# EAGLE schematic StreamDeck (EAGLE 9.6.2)
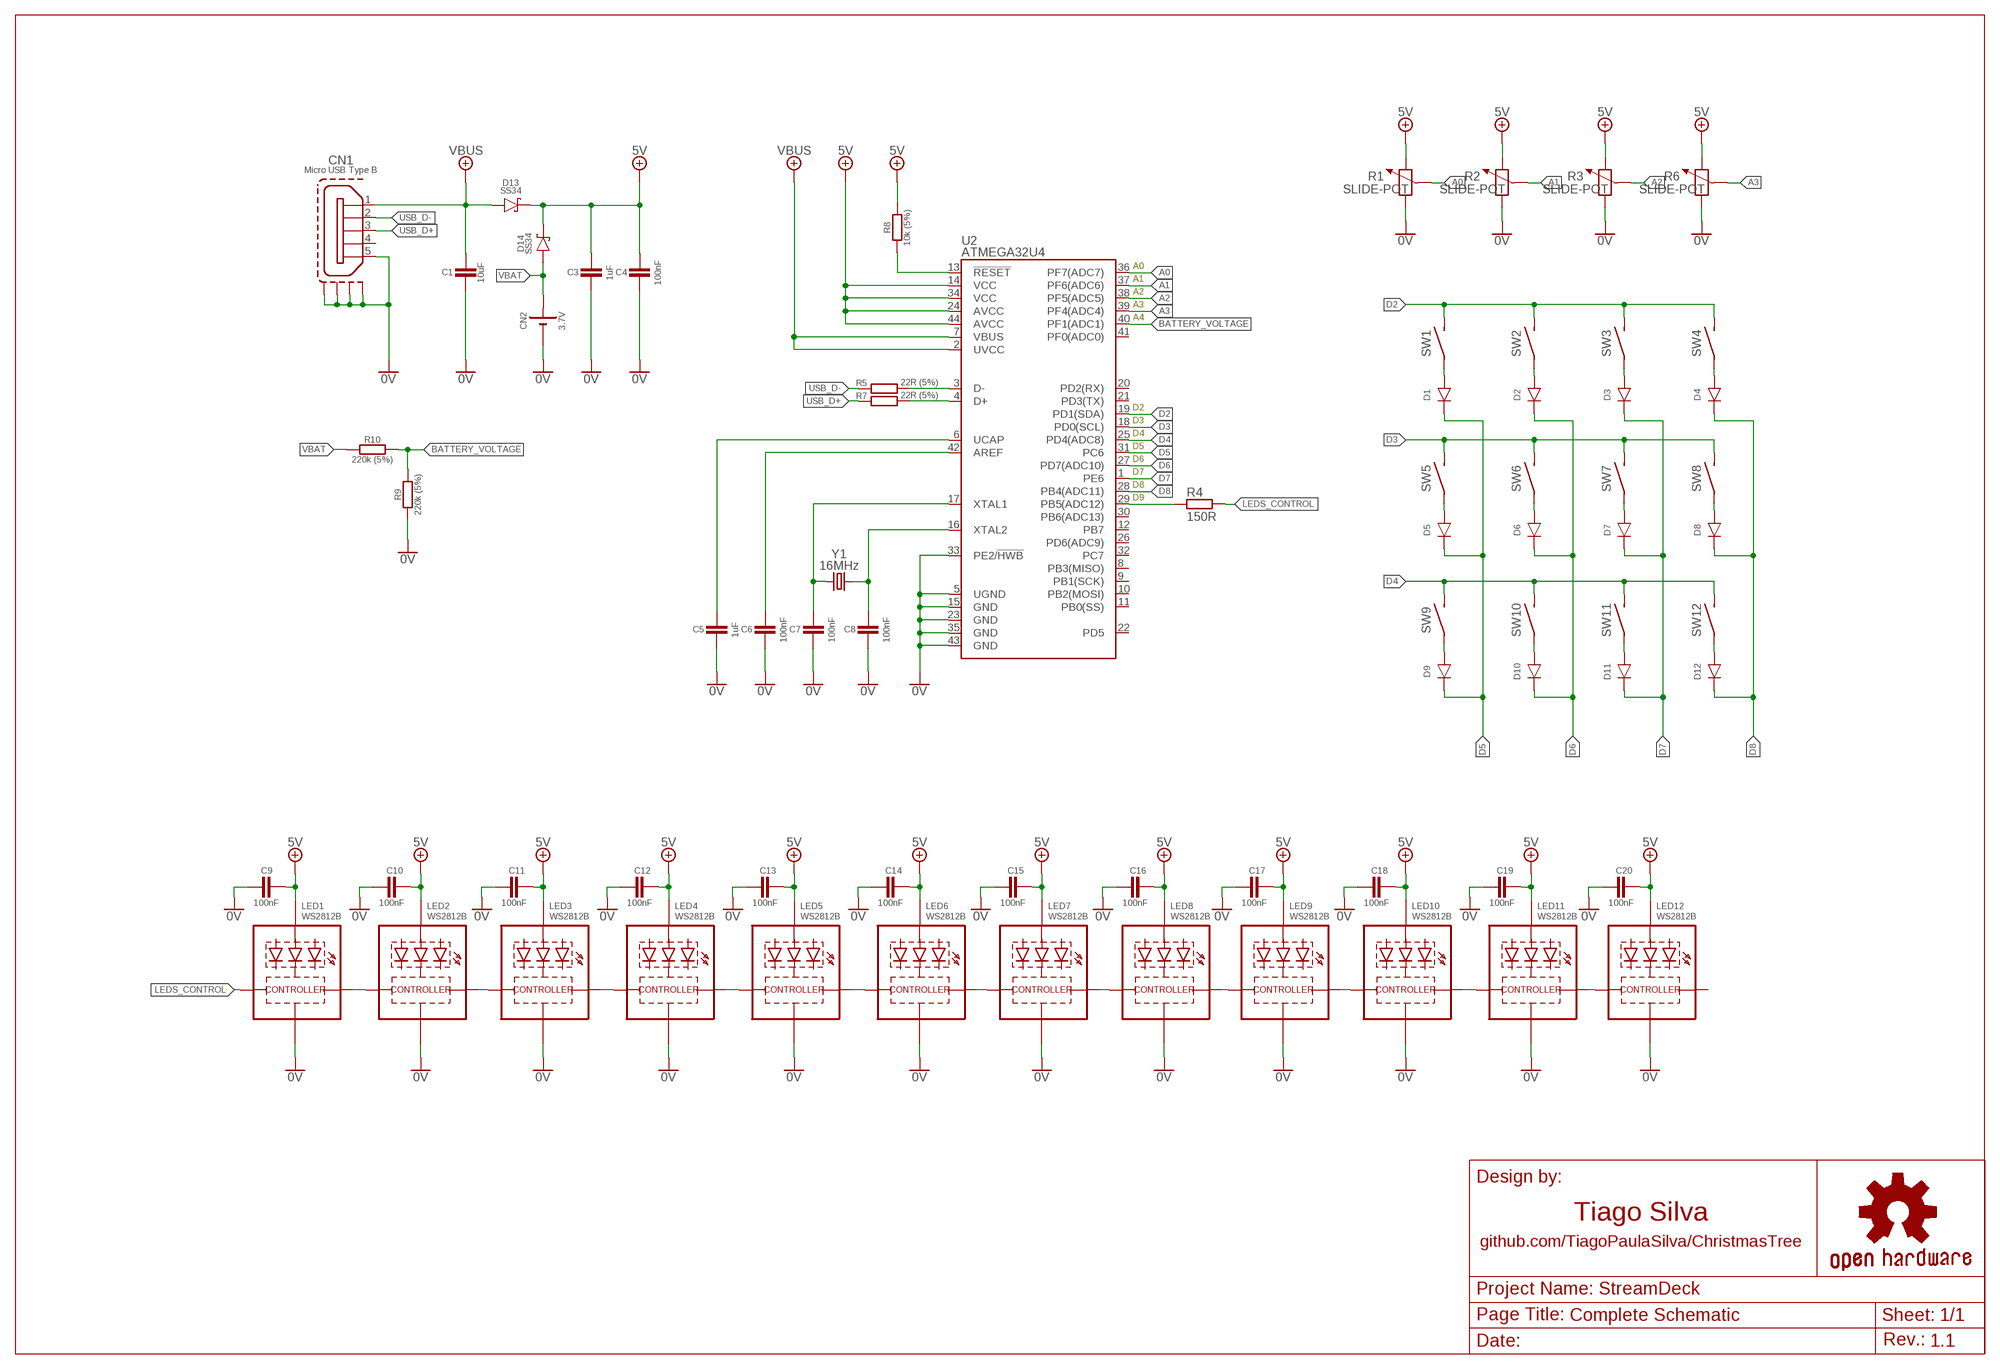
[diagram p0: schematic, sheet 1]

## Parts
C1  10uF  C_0805  [C0805]
C3  1uF  C_0603  [C0603]
C4  100nF  C_0603  [C0603]
C5  1uF  C_0603  [C0603]
C6  100nF  C_0603  [C0603]
C7  100nF  C_0603  [C0603]
C8  100nF  C_0603  [C0603]
C9  100nF  C_0603  [C0603]
C10  100nF  C_0603  [C0603]
C11  100nF  C_0603  [C0603]
C12  100nF  C_0603  [C0603]
C13  100nF  C_0603  [C0603]
C14  100nF  C_0603  [C0603]
C15  100nF  C_0603  [C0603]
C16  100nF  C_0603  [C0603]
C17  100nF  C_0603  [C0603]
C18  100nF  C_0603  [C0603]
C19  100nF  C_0603  [C0603]
C20  100nF  C_0603  [C0603]
CN1  Micro USB Type B  MICRO-USB  [10118193-0001LF]
CN2  3.7V  CELL-CONNECTOR  [JST-PH2]
D1  LL4148  [SOD80]
D2  LL4148  [SOD80]
D3  LL4148  [SOD80]
D4  LL4148  [SOD80]
D5  LL4148  [SOD80]
D6  LL4148  [SOD80]
D7  LL4148  [SOD80]
D8  LL4148  [SOD80]
D9  LL4148  [SOD80]
D10  LL4148  [SOD80]
D11  LL4148  [SOD80]
D12  LL4148  [SOD80]
D13  SS34  [DO214AB]
D14  SS34  [DO214AB]
LED1  WS2812B  [5050]
LED2  WS2812B  [5050]
LED3  WS2812B  [5050]
LED4  WS2812B  [5050]
LED5  WS2812B  [5050]
LED6  WS2812B  [5050]
LED7  WS2812B  [5050]
LED8  WS2812B  [5050]
LED9  WS2812B  [5050]
LED10  WS2812B  [5050]
LED11  WS2812B  [5050]
LED12  WS2812B  [5050]
R1  SLIDE-POT  [SLIDER-75MM]
R2  SLIDE-POT  [SLIDER-75MM]
R3  SLIDE-POT  [SLIDER-75MM]
R4  150R  R_0603  [R0603]
R5  22R (5%)  R_0603  [R0603]
R6  SLIDE-POT  [SLIDER-75MM]
R7  22R (5%)  R_0603  [R0603]
R8  10k (5%)  R_0603  [R0603]
R9  220k (5%)  R_0603  [R0603]
R10  220k (5%)  R_0603  [R0603]
SW1  CHERRY_MX  [CHERRY-MX]
SW2  CHERRY_MX  [CHERRY-MX]
SW3  CHERRY_MX  [CHERRY-MX]
SW4  CHERRY_MX  [CHERRY-MX]
SW5  CHERRY_MX  [CHERRY-MX]
SW6  CHERRY_MX  [CHERRY-MX]
SW7  CHERRY_MX  [CHERRY-MX]
SW8  CHERRY_MX  [CHERRY-MX]
SW9  CHERRY_MX  [CHERRY-MX]
SW10  CHERRY_MX  [CHERRY-MX]
SW11  CHERRY_MX  [CHERRY-MX]
SW12  CHERRY_MX  [CHERRY-MX]
U2  ATMEGA32U4  TESTING_ATMEGA32U4QFN  [TESTING_QFN-44]
Y1  16MHz  KX-9A  [5.0X3.2_KX-9A]

## Nets
0V: C1.2 C3.2 C4.2 C5.2 C6.2 C7.2 C8.2 C9.2 C10.2 C11.2 C12.2 C13.2 C14.2 C15.2 C16.2 C17.2 C18.2 C19.2 C20.2 CN1.5 CN1.MP1(S1) CN1.MP2(S2) CN1.MP3(S3) CN1.MP4(S4) CN2.2(-) LED1.3-GND(GND) LED2.3-GND(GND) LED3.3-GND(GND) LED4.3-GND(GND) LED5.3-GND(GND) LED6.3-GND(GND) LED7.3-GND(GND) LED8.3-GND(GND) LED9.3-GND(GND) LED10.3-GND(GND) LED11.3-GND(GND) LED12.3-GND(GND) R1.P$1 R2.P$1 R3.P$1 R6.P$1 R9.1 U2.5(UGND) U2.15(GND) U2.23(GND) U2.33(PE2/!HWB) U2.35(GND) U2.43(GND)
5V: C3.1 C4.1 C9.1 C10.1 C11.1 C12.1 C13.1 C14.1 C15.1 C16.1 C17.1 C18.1 C19.1 C20.1 D13.C(K) D14.C(K) LED1.1-VDD(VDD) LED2.1-VDD(VDD) LED3.1-VDD(VDD) LED4.1-VDD(VDD) LED5.1-VDD(VDD) LED6.1-VDD(VDD) LED7.1-VDD(VDD) LED8.1-VDD(VDD) LED9.1-VDD(VDD) LED10.1-VDD(VDD) LED11.1-VDD(VDD) LED12.1-VDD(VDD) R1.P$2 R2.P$2 R3.P$2 R6.P$2 R8.2 U2.14(VCC) U2.24(AVCC) U2.34(VCC) U2.44(AVCC)
A0: R1.P$6 U2.36(PF7(ADC7))
A1: R2.P$6 U2.37(PF6(ADC6))
A2: R3.P$6 U2.38(PF5(ADC5))
A3: R6.P$6 U2.39(PF4(ADC4))
BATTERY_VOLTAGE: R9.2 R10.2 U2.40(PF1(ADC1))
D2: SW1.SW2 SW2.SW2 SW3.SW2 SW4.SW2 U2.19(PD1(SDA))
D3: SW5.SW2 SW6.SW2 SW7.SW2 SW8.SW2 U2.18(PD0(SCL))
D4: SW9.SW2 SW10.SW2 SW11.SW2 SW12.SW2 U2.25(PD4(ADC8))
D5: D1.1(K) D5.1(K) D9.1(K) U2.31(PC6)
D6: D2.1(K) D6.1(K) D10.1(K) U2.27(PD7(ADC10))
D7: D3.1(K) D7.1(K) D11.1(K) U2.1(PE6)
D8: D4.1(K) D8.1(K) D12.1(K) U2.28(PB4(ADC11))
LEDS_CONTROL: LED1.4-DIN(DI) R4.2
N$1: D1.2(A) SW1.SW1
N$2: D2.2(A) SW2.SW1
N$3: D3.2(A) SW3.SW1
N$4: D4.2(A) SW4.SW1
N$5: LED1.2-DOUT(DO) LED2.4-DIN(DI)
N$6: D5.2(A) SW5.SW1
N$7: D6.2(A) SW6.SW1
N$8: D7.2(A) SW7.SW1
N$9: D8.2(A) SW8.SW1
N$10: LED3.2-DOUT(DO) LED4.4-DIN(DI)
N$11: D9.2(A) SW9.SW1
N$12: D10.2(A) SW10.SW1
N$13: D11.2(A) SW11.SW1
N$14: D12.2(A) SW12.SW1
N$15: LED2.2-DOUT(DO) LED3.4-DIN(DI)
N$16: LED5.2-DOUT(DO) LED6.4-DIN(DI)
N$17: LED6.2-DOUT(DO) LED7.4-DIN(DI)
N$18: LED4.2-DOUT(DO) LED5.4-DIN(DI)
N$19: LED8.2-DOUT(DO) LED9.4-DIN(DI)
N$20: LED10.2-DOUT(DO) LED11.4-DIN(DI)
N$21: LED9.2-DOUT(DO) LED10.4-DIN(DI)
N$22: LED11.2-DOUT(DO) LED12.4-DIN(DI)
N$23: LED7.2-DOUT(DO) LED8.4-DIN(DI)
N$24: C5.1 U2.6(UCAP)
N$25: C6.1 U2.42(AREF)
N$26: C7.1 U2.17(XTAL1) Y1.1
N$27: C8.1 U2.16(XTAL2) Y1.3
N$28: R4.1 U2.29(PB5(ADC12))
N$29: R7.2 U2.4(D+)
N$30: R5.2 U2.3(D-)
RESET: R8.1 U2.13(!RESET)
USB_D+: CN1.3 R7.1
USB_D-: CN1.2 R5.1
VBAT: CN2.1(+) D14.A R10.1
VBUS: C1.1 CN1.1 D13.A U2.2(UVCC) U2.7(VBUS)
Unconnected: CN1.4 LED12.2-DOUT(DO) U2.8(PB3(MISO)) U2.9(PB1(SCK)) U2.10(PB2(MOSI)) U2.11(PB0(SS)) U2.12(PB7) U2.20(PD2(RX)) U2.21(PD3(TX)) U2.22(PD5) U2.26(PD6(ADC9)) U2.30(PB6(ADC13)) U2.32(PC7) U2.41(PF0(ADC0))

## Notes on the sheet
- A0
- A1
- A2
- A3
- A4
- D2
- D3
- D4
- D5
- D6
- D7
- D8
- D9
- Tiago Silva
- github.com/TiagoPaulaSilva/ChristmasTree
- Complete Schematic
- 1.1

## Library data of the parts
C1 C3-C20 = My-RLC:C_: NON-POLARIZED CAP
CN1 = My-Connectors:MICRO-USB: Micro USB Type B Connector - Standard, Shell Through Hole Source: http://www.hirose.co.jp/cataloge_hp/ed_ZX_20140804.pdf; PN: 10118193-0001LF
CN2 = My-Battery:CELL-CONNECTOR
D1-D12 = My-Diodes:LL4148
D13 D14 = My-Diodes:SS34
LED1-LED12 = My-LED:WS2812B: Intelligent control circuit and RGB chip integrated in a single 5050 package, providing a complete control of pixel point
R1-R3 R6 = My-Potentiometers:SLIDE-POT
R4 R5 R7-R10 = My-RLC:R_: RESISTOR
SW1-SW12 = My-Switches:CHERRY_MX
U2 = SparkFun_Pro_Micro_v13a:TESTING_ATMEGA32U4: Atmel 44-pin 8-bit Microcontroller with 32KBytes of ISP Flash and USB Controller
Y1 = crystal-geyer_V1_0:KX: Quartz Crystals (MHz) SMD: KX - Serie Model Size l/w/h [mm] Frequency Range Frequency Stability Temp. Range [°C] Load Capacitance AECQ 200 availabel Datasheet KX-4 KX-5 KX-6 KX-7 KX-9A KX-9B KX-12A KX-12B KX-13 KX-20 KX-K KX-KS 1.6/1.2/0.3 2.0/1.6/0.45 2.5/2.0/0.55 3.2/2.5/0.8 5.0/3.2/1.0 5.0/3.2/1.1 6.0/3.5/1.1 6.0/3.5/1.0 7.0/5.0 /1.3 11.6/5.5/1.6 12.3/4.5/4.2 12.3/4.5/3.2 24.0 ~ 80.0 MHz 16.0 ~ 80.0 MHz 12.0 ~ 80.0 MHz 8.0 ~ 60.0 MHz 7,68 ~ 300,0 MHz 8,0 ~ 50,0 MHz 8,0 ~ 150,0 MHz 8,0 ~ 50,0 MHz 6,0 ~ 160,0 MHz 3,579 ~ 25,0 MHz 3,579 ~ 70,0 MHz 3,579 ~ 70,0 MHz ±10 … ±50ppm ±10 … ±50ppm ±10 … ±50ppm ±10 … ±50ppm ±10 … ±50ppm ±10 … ±50ppm ±10 … ±50ppm ±10 … ±50ppm ±10 … ±50ppm ±50ppm ±10 … ±50ppm ±10 … ±50ppm (*) -40°C …+85°C (*) -40°C …+125°C (*) -40°C …+125°C (*) -40°C …+125°C (*) -40°C …+105°C (*) -40°C …+105°C (*) -40°C …+125°C (*) -40°C …+105°C (*) -40°C …+105°C (*) -40°C …+105°C (*) -40°C …+85°C (*) -40°C …+85°C 8, 8…16 8, 8…16 10, 8…16 12, 7…20 16, 10…20 16, 10…20 16, 10…20 16, 12…20 16, 12…20 16, 12…20 16, 12…30 16, 12…30 - yes yes yes - - - - - - - - KX-4.pdf <http://www.geyer-electronic.de/uploads/tx_userartikelfrequenz/GEYER-KX-4.pdf> KX-5.pdf <http://www.geyer-electronic.de/uploads/tx_userartikelfrequenz/GEYER-KX-5.pdf> KX-6.pdf <http://www.geyer-electronic.de/uploads/tx_userartikelfrequenz/GEYER-KX-6.pdf> KX-7.pdf <http://www.geyer-electronic.de/uploads/tx_userartikelfrequenz/GEYER-KX-7.pdf> KX-9A.pdf <http://www.geyer-electronic.de/uploads/tx_userartikelfrequenz/GEYER-KX-9A.pdf> KX-9B.pdf <http://www.geyer-electronic.de/uploads/tx_userartikelfrequenz/GEYER-KX-9B.pdf> KX-12A.pdf <http://www.geyer-electronic.de/uploads/tx_userartikelfrequenz/GEYER-KX-12A.pdf> KX-12B.pdf <http://www.geyer-electronic.de/uploads/tx_userartikelfrequenz/GEYER-KX-12B.pdf> KX-13.pdf <http://www.geyer-electronic.de/uploads/tx_userartikelfrequenz/GEYER-KX-13.pdf> KX-20.pdf <http://www.geyer-electronic.de/uploads/tx_userartikelfrequenz/GEYER-KX-20.pdf> KX-K.pdf <http://www.geyer-electronic.de/uploads/tx_userartikelfrequenz/GEYER-KX-K.pdf> KX-KS.pdf <http://www.geyer-electronic.de/uploads/tx_userartikelfrequenz/GEYER-KX-KS.pdf> <http://www.geyer-electronic.de/fileadmin/template/img/logo-geyer-electronic.png> Details see: http://www.geyer-electronic.de/Frequenz-Produkte.9.0.html Created 2016-06-07, Hans Locher 2016 (C) Geyer Quartz Technology KX4,KX5,KX6,KX7,KX9A,KX9B,KX12A,KX12B,KX13,KX20,KXK,KXKS;1612;2016;2520;3225;5032;6035;7050;11655;12345;1,6x1,2;2,0x1,6;2,5x2,0;3,2x2,5;5,0x3,2;6,0x3,5;7,0x5,0;11,6x5,5;12,3x4,5;12,3x4,5;1.6x1.2;2.0x1.6;2.5x2.0;3.2x2.5;5.0x3.2;6.0x3.5;7.0x5.0;11.6x5.5;12.3x4.5;12.3x4.5;

## Net classes
0 default: width 0.203 mm